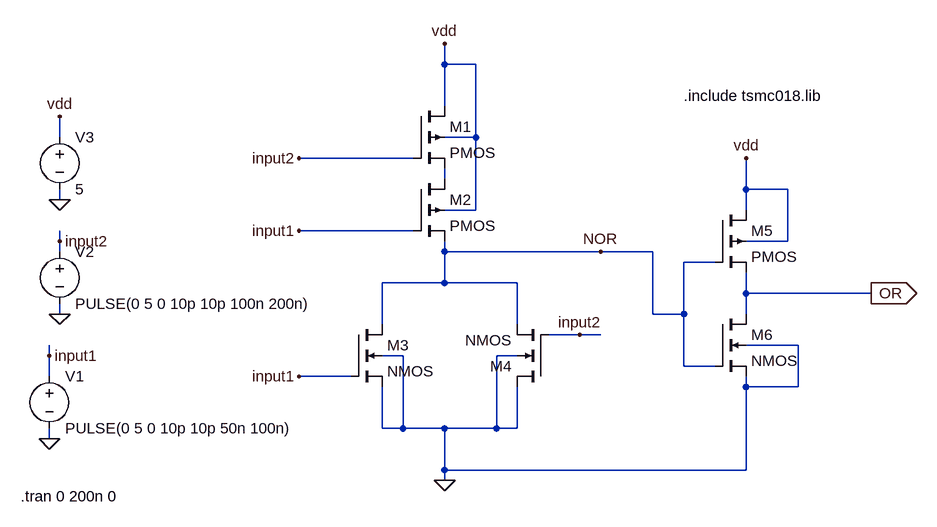
[diagram p0: schematic or_gate.asc]
or_gate.asc, the LTspice schematic file:
Version 4
SHEET 1 1016 680
WIRE 256 -176 256 -208
WIRE 304 -176 256 -176
WIRE 256 -112 256 -176
WIRE -336 -64 -336 -96
WIRE 304 -64 304 -176
WIRE 304 -64 256 -64
WIRE 208 -32 32 -32
WIRE 256 0 256 -16
WIRE 720 16 720 -32
WIRE 784 16 720 16
WIRE -336 32 -336 16
WIRE 304 48 304 -64
WIRE 304 48 256 48
WIRE 720 48 720 16
WIRE 208 80 32 80
WIRE -336 96 -336 80
WIRE 784 96 784 16
WIRE 784 96 720 96
WIRE -336 112 -336 96
WIRE 256 112 256 96
WIRE 496 112 256 112
WIRE 576 112 496 112
WIRE 672 128 624 128
WIRE 256 160 256 112
WIRE 256 160 160 160
WIRE 368 160 256 160
WIRE 720 176 720 144
WIRE 912 176 720 176
WIRE -336 208 -336 192
WIRE 576 208 576 112
WIRE 624 208 624 128
WIRE 624 208 576 208
WIRE 720 208 720 176
WIRE 160 224 160 160
WIRE 368 224 368 160
WIRE 464 240 416 240
WIRE 496 240 464 240
WIRE 800 256 720 256
WIRE -352 272 -352 256
WIRE 192 272 160 272
WIRE 368 272 336 272
WIRE 624 288 624 208
WIRE 672 288 624 288
WIRE -352 304 -352 272
WIRE 112 304 32 304
WIRE 720 320 720 304
WIRE 800 320 800 256
WIRE 800 320 720 320
WIRE 160 384 160 320
WIRE 192 384 192 272
WIRE 192 384 160 384
WIRE 256 384 192 384
WIRE 336 384 336 272
WIRE 336 384 256 384
WIRE 368 384 368 320
WIRE 368 384 336 384
WIRE -352 400 -352 384
WIRE 256 448 256 384
WIRE 720 448 720 320
WIRE 720 448 256 448
WIRE 256 464 256 448
FLAG 256 464 0
FLAG -352 400 0
FLAG -336 208 0
FLAG -336 32 0
FLAG -352 272 input1
FLAG -336 96 input2
FLAG -336 -96 vdd
FLAG 720 -32 vdd
FLAG 256 -208 vdd
FLAG 32 -32 input2
FLAG 464 240 input2
FLAG 32 304 input1
FLAG 32 80 input1
FLAG 496 112 NOR
FLAG 912 176 OR
IOPIN 912 176 Out
SYMBOL pmos4 672 48 R0
SYMATTR InstName M5
SYMATTR Value2 l=1.8u w=2.18u
SYMBOL nmos4 672 208 R0
SYMATTR InstName M6
SYMATTR Value2 l=1.8u w=1u
SYMBOL voltage -352 288 R0
WINDOW 123 0 0 Left 0
WINDOW 39 0 0 Left 0
SYMATTR InstName V1
SYMATTR Value PULSE(0 5 0 10p 10p 50n 100n)
SYMBOL voltage -336 96 R0
WINDOW 123 0 0 Left 0
WINDOW 39 0 0 Left 0
SYMATTR InstName V2
SYMATTR Value PULSE(0 5 0 10p 10p 100n 200n)
SYMBOL voltage -336 -80 R0
WINDOW 123 0 0 Left 0
WINDOW 39 0 0 Left 0
SYMATTR InstName V3
SYMATTR Value 5
SYMBOL pmos4 208 -112 R0
SYMATTR InstName M1
SYMATTR Value2 l=1.8u w=4.36u
SYMBOL pmos4 208 0 R0
SYMATTR InstName M2
SYMATTR Value2 l=1.8u w=4.36u
SYMBOL nmos4 112 224 R0
SYMATTR InstName M3
SYMATTR Value2 l=1.8u w=1u
SYMBOL nmos4 416 320 R180
SYMATTR InstName M4
SYMATTR Value2 l=1.8u w=1u
TEXT 624 -128 Left 2 !.include tsmc018.lib
TEXT -396 488 Left 2 !.tran 0 200n 0

The netlist it stands for:
* or_gate.asc
M5 vdd NOR OR vdd PMOS l=1.8u w=2.18u
M6 OR NOR 0 0 NMOS l=1.8u w=1u
V1 input1 0 PULSE(0 5 0 10p 10p 50n 100n)
V2 input2 0 PULSE(0 5 0 10p 10p 100n 200n)
V3 vdd 0 5
M1 vdd input2 N001 vdd PMOS l=1.8u w=4.36u
M2 N001 input1 NOR vdd PMOS l=1.8u w=4.36u
M3 NOR input1 0 0 NMOS l=1.8u w=1u
M4 0 input2 NOR 0 NMOS l=1.8u w=1u
.model NMOS NMOS
.model PMOS PMOS
.lib standard.mos
.include tsmc018.lib
.tran 0 200n 0
.backanno
.end